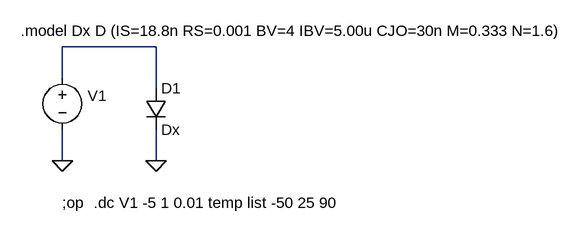
[diagram p0: schematic DiodeModel.asc]
DiodeModel.asc, the LTspice schematic file:
Version 4
SHEET 1 880 680
WIRE 16 240 -128 240
WIRE -128 288 -128 240
WIRE 16 304 16 240
WIRE -128 416 -128 368
WIRE 16 416 16 368
FLAG -128 416 0
FLAG 16 416 0
SYMBOL diode 0 304 R0
SYMATTR InstName D1
SYMATTR Value Dx
SYMBOL voltage -128 272 R0
WINDOW 123 0 0 Left 2
WINDOW 39 0 0 Left 2
WINDOW 3 40 89 Left 2
WINDOW 0 39 44 Left 2
SYMATTR Value ""
SYMATTR InstName V1
TEXT -128 480 Left 2 !;op
TEXT -192 216 Left 2 !.model Dx D (IS=18.8n RS=0.001 BV=4 IBV=5.00u CJO=30n M=0.333 N=1.6)
TEXT -80 480 Left 2 !.dc V1 -5 1 0.01 temp list -50 25 90

The netlist it stands for:
* DiodeModel.asc
D1 N001 0 Dx
V1 N001 0
.model D D
.lib standard.dio
;op
.model Dx D (IS=18.8n RS=0.001 BV=4 IBV=5.00u CJO=30n M=0.333 N=1.6)
.dc V1 -5 1 0.01 temp list -50 25 90
.backanno
.end